# EAGLE schematic led_single_prototype_arduino_uno (EAGLE 9.2.2)
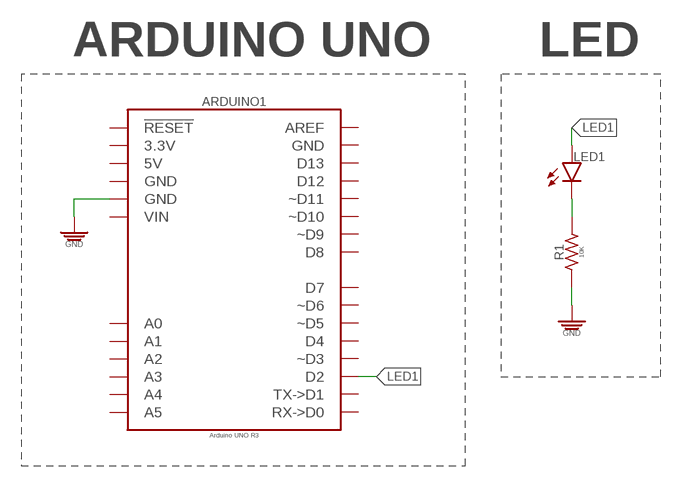
[diagram p0: schematic, sheet 1]

## Parts
ARDUINO1  Arduino UNO R3  ARDUINO_UNO_R3_NO-HOLES_NO-AVR-ISP_NO-I2C_NO-NC_NO-IOREF  [ARDUINO_UNO_R3_NO-HOLES_NO-AVR-ISP_NO-I2C_NO-NC_NO-IOREF]
LED1  LED_PTH_T-1_3/4_5MM_NO-COLOR  [LED_PTH_T-1_3/4_5MM]
R1  10K  10KΩ_PTH-204/7_1/6W-5%  [RESAD660W45L340D190B]

## Nets
GND: ARDUINO1.GND@2(GND) R1.1
LED1: ARDUINO1.D2 LED1.A
N$1: LED1.K R1.2
Unconnected: ARDUINO1.3.3V ARDUINO1.5V ARDUINO1.A0 ARDUINO1.A1 ARDUINO1.A2 ARDUINO1.A3 ARDUINO1.A4 ARDUINO1.A5 ARDUINO1.AREF ARDUINO1.D0(RX->D0) ARDUINO1.D1(TX->D1) ARDUINO1.D3(~D3) ARDUINO1.D4 ARDUINO1.D5(~D5) ARDUINO1.D6(~D6) ARDUINO1.D7 ARDUINO1.D8 ARDUINO1.D9(~D9) ARDUINO1.D10(~D10) ARDUINO1.D11(~D11) ARDUINO1.D12 ARDUINO1.D13 ARDUINO1.GND@1(GND) ARDUINO1.GND@3(GND) ARDUINO1.RESET@1(!RESET) ARDUINO1.VIN

## Notes on the sheet
- ARDUINO UNO | LED

## Library data of the parts
ARDUINO1 = PiB_boards:ARDUINO_UNO_R3_NO-HOLES_NO-AVR-ISP_NO-I2C_NO-NC_NO-IOREF; DATASHEET: https://media.digikey.com/pdf/Data%20Sheets/Arduino%20PDFs/A000066_Web.pdf; DATASHEET_CABLE: http://www.assmann-wsw.com/fileadmin/datasheets/ASS_7066_CA.pdf; DATASHEET_CONNECTOR: http://www.sullinscorp.com/drawings/77____C___S___N-OMIT,_M500,_STRAIGHT,_C10436.pdf; DIST: Digikey; DISTLINK: https://www.digikey.com/products/en?keywords=1050-1024-ND; DISTLINK_CABLE: https://www.digikey.com/products/en?keywords=AE1462-ND; DISTLINK_CONNECTOR1: https://www.digikey.com/products/en?keywords=S1012E-06-ND; DISTLINK_CONNECTOR2: https://www.digikey.com/products/en?keywords=PEC08SAAN; DISTPN: 1050-1024-ND; DISTPN_CABLE: AE1462-ND; DISTPN_CONNECTOR1: S1012E-06-ND; DISTPN_CONNECTOR2: S1012E-08-ND; DIST_CABLE: Digikey; DIST_CONNECTOR: Digikey; MFR: Arduino; MFR_CABLE: Assmann WSW Components; MFR_CONNECTOR: Sullins Connector Solutions; MPN: A000066; MPN_CABLE: AK672/2-1; MPN_CONNECTOR1: PEC06SAAN; MPN_CONNECTOR2: PEC08SAAN; QTY_CONNECTOR1: 2; QTY_CONNECTOR2: 2
LED1 = PiB_leds:LED
R1 = PiB_resistors:10KΩ; DATASHEET: http://www.yageo.com/NewPortal/yageodocoutput?fileName=/pdf/throughhole/Yageo_LR_CFR_2013.pdf; DIST: Digikey; DISTLINK: https://www.digikey.com/products/en?keywords=CFR-12JB-52-10K; DISTPN: 10KEBK-ND; MFR: Yageo; MPN: CFR-12JB-52-10K